# Altium schematic sheet Dual_opto_input.SchDoc
size A4; DocumentNumber: 2; SheetNumber: 2; SheetTotal: 5
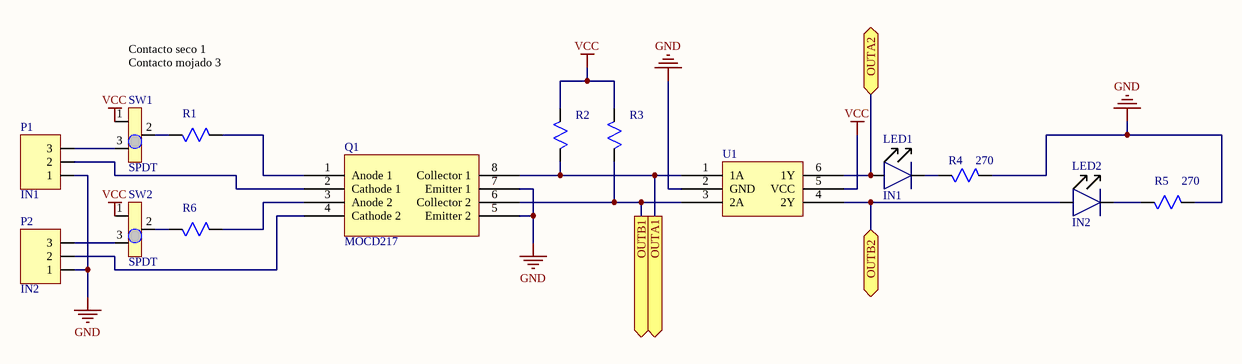
[diagram p0: Dual_opto_input.SchDoc]

## Parts
LED1  IN1  [SMD1206]
LED2  IN2  [SMD1206]
P1  IN1  [TBHDR3P3.5]
P2  IN2  [TBHDR3P3.5]
Q1  MOCD217  [SOIC8]
R1  (no value)  [ResistorSMD0805]
R2  (no value)  [ResistorSMD0805]
R3  (no value)  [ResistorSMD0805]
R4  270  [ResistorSMD0805]
R5  270  [ResistorSMD0805]
R6  (no value)  [ResistorSMD0805]
SW1  SPDT  [SPDT SMD]
SW2  SPDT  [SPDT SMD]
U1  Inverter2x2  [Inverter2x2]  (value not drawn)

## Ports
OUTA1 (out), OUTA2, OUTB1 (out), OUTB2

## Nets
GND: P1.1 P2.1 Q1.5(Emitter_2) Q1.7(Emitter_1) R4.1 R5.1 U1.2(GND)
VCC: R2.1 R3.1 SW1.1 SW2.1 U1.5(VCC)
OUTA1: Q1.8(Collector_1) R2.2 U1.1(1A) ; port OUTA1
OUTA2: LED1.2 U1.6(1Y) ; port OUTA2
OUTB1: Q1.6(Collector_2) R3.2 U1.3(2A) ; port OUTB1
OUTB2: LED2.2 U1.4(2Y) ; port OUTB2
NetLED1_1: LED1.1 R4.2
NetLED2_1: LED2.1 R5.2
NetP1_2: P1.2 Q1.2(Cathode_1)
NetP1_3: P1.3 SW1.3
NetP2_2: P2.2 Q1.4(Cathode_2)
NetP2_3: P2.3 SW2.3
NetQ1_1: Q1.1(Anode_1) R1.1
NetQ1_3: Q1.3(Anode_2) R6.1
NetR1_2: R1.2 SW1.2
NetR6_2: R6.2 SW2.2

## Notes on the sheet
- Contacto seco 1
  Contacto mojado 3

## Library data of the parts
LED1 LED2 = LedSMD: Discrete Led SMD; Manufacturer Name: Lite-On Inc.; Manufacturers Part Number: LTST-C150GKT; PartDescription: LED GREEN CLEAR 1206 SMD; Digi-Key Part Number: 160-1169-1-ND; Package: 1206 (3216 Metric); Type: SMD
P1 P2 = TBHDR3P3.5: Connector 3 positions with pitch 3.5mm; Manufacturer Name: Phoenix Contact; Manufacturers Part Number: 1897102; PartDescription: TERM BLOCK HDR 3POS 90DEG 3.5MM; Accesorios PN: 277-2413-ND; Digi-Key Part Number: 277-11008-ND; Package: 3POS; Type: Thru-hole
Q1 = MOCD217: Optocoupler; Manufacturer Name: ON Semiconductor; Manufacturers Part Number: MOCD217R2M; PartDescription: OPTOISO 2.5KV 2CH TRANS 8SOIC; Type: SMD; Digi-Key Part Number: MOCD217R2MCT-ND; Package: 8-SOIC
R1-R3 R6 = ResistorSMD: Chip Resistor SMD; Manufacturer Name: Yageo; Manufacturers Part Number: RC0805FR-07680RL; PartDescription: RES SMD 680 OHM 1% 1/8W 0805; Digi-Key Part Number: 311-680CRCT-ND; Package: 0805; Type: SMD
R4 R5 = ResistorSMD: Chip Resistor SMD; Manufacturer Name: Yageo; Manufacturers Part Number: AC0805FR-07270RL; PartDescription: RES SMD 270 OHM 1% 1/8W 0805; Digi-Key Part Number: YAG3714CT-ND; Package: 0805; value: 270; Type: SMD
SW1 SW2 = SW_SPDT: 200mA 12V; Manufacturer Name: Nidec Copal Electronics; Manufacturers Part Number: CL-SB-12B-01T; PartDescription: SWITCH SLIDE SPDT 200MA 12V; Digi-Key Part Number: 563-1318-1-ND; Package: SMD; Type: SMD
U1 = Inverter2x2: Logic Inverter 2 Circuits; Manufacturer Name: Texas Instruments; Manufacturers Part Number: SN74AUP2G14DCKR; PartDescription: IC INVERTER SCHMITT 2CH SC70-6; Digi-Key Part Number: 296-27361-1-ND; Package: SC-70-6; Type: SMD